# Altium schematic sheet MCU_Module.SchDoc
size A3
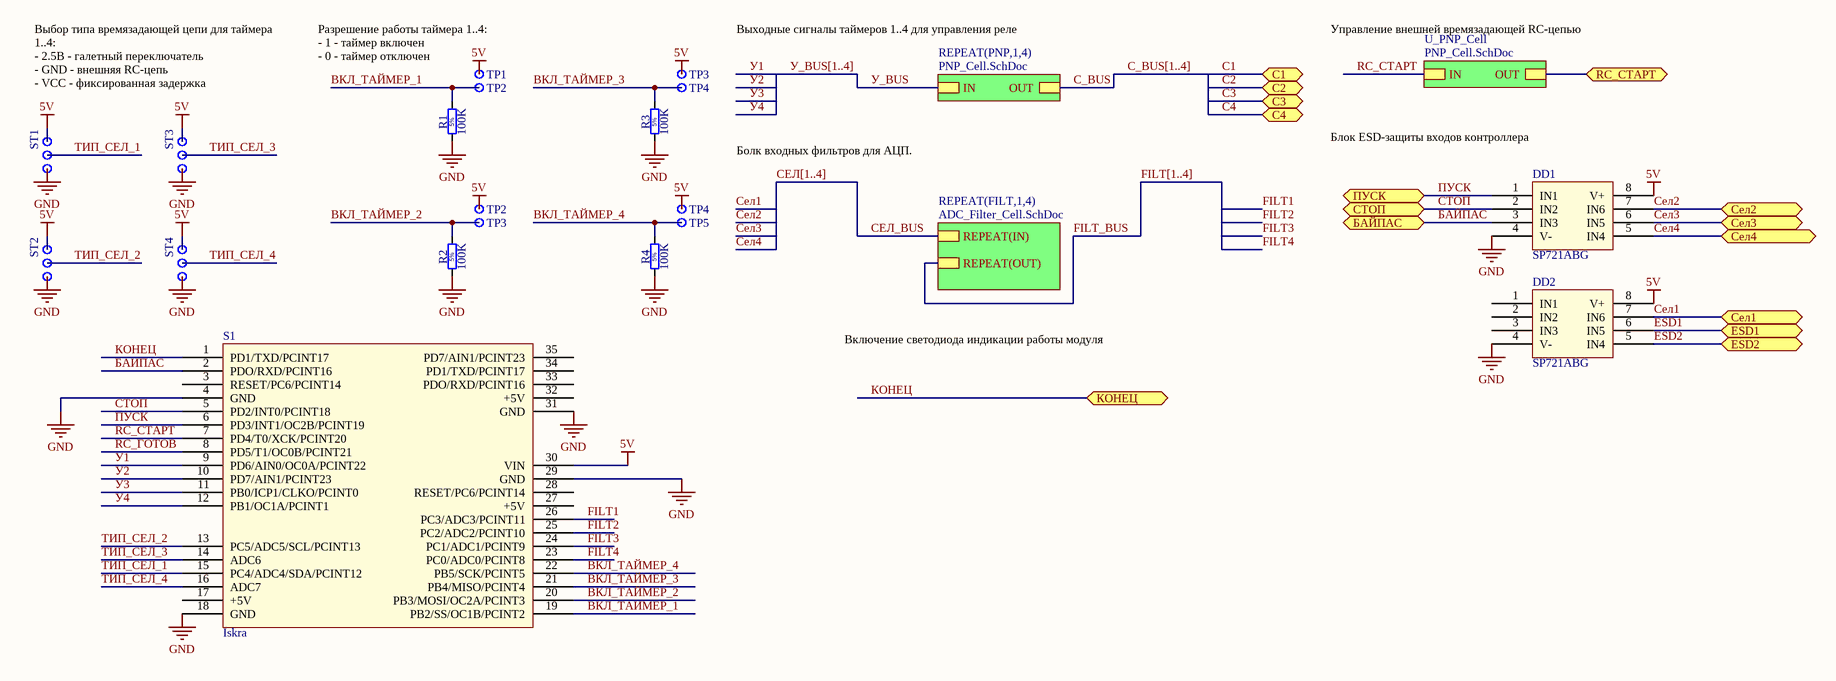
[diagram p0: MCU_Module.SchDoc]

## Parts
(Parts that share a designator on the sheet are numbered #1, #2 ... from top to bottom, then left to right.)
B12  Plated Hole  [MTG300_700]  (value not drawn)
B13  Plated Hole  [MTG300_700]  (value not drawn)
B14  Plated Hole  [MTG300_700]  (value not drawn)
B15  Plated Hole  [MTG300_700]  (value not drawn)
B22  Plated Hole  [MTG300_700]  (value not drawn)
B23  Plated Hole  [MTG300_700]  (value not drawn)
B24  Plated Hole  [MTG300_700]  (value not drawn)
B25  Plated Hole  [MTG300_700]  (value not drawn)
DD1  SP721ABG  [SOIC127P594X363-8N]
DD2  SP721ABG  [SOIC127P594X363-8N]
R1  100K  [RES_ARCOL_RCC025]
R2  100K  [RES_ARCOL_RCC025]
R3  100K  [RES_ARCOL_RCC025]
R4  100K  [RES_ARCOL_RCC025]
S1  Iskra  [Iskra]
ST1  Plated Hole  [MTG300_700]  (value not drawn)
ST2  Plated Hole  [MTG300_700]  (value not drawn)
ST3  Plated Hole  [MTG300_700]  (value not drawn)
ST4  Plated Hole  [MTG300_700]  (value not drawn)
TP1  Test Point  [TPS127]  (value not drawn)
TP2#1  Test Point  [TPS127]  (value not drawn)
TP2#2  Test Point  [TPS127]  (value not drawn)
TP3#1  Test Point  [TPS127]  (value not drawn)
TP3#2  Test Point  [TPS127]  (value not drawn)
TP4#1  Test Point  [TPS127]  (value not drawn)
TP4#2  Test Point  [TPS127]  (value not drawn)
TP5  Test Point  [TPS127]  (value not drawn)

## Sub-sheets
REPEAT(FILT,1,4) = ADC_Filter_Cell.SchDoc: REPEAT(IN), REPEAT(OUT)
REPEAT(PNP,1,4) = PNP_Cell.SchDoc: OUT, IN
U_PNP_Cell = PNP_Cell.SchDoc: OUT, IN

## Ports
ESD1, ESD2, RC_СТАРТ, БАЙПАС, КОНЕЦ, ПУСК, С1, С2, С3, С4, Сел1, Сел2, Сел3, Сел4, СТОП

## Nets
5V: B12.1 B13.1 B14.1 B15.1 DD1.8(V+) DD2.8(V+) S1.30(VIN) TP1.1 TP2#2.1 TP3#1.1 TP4#2.1
GND: B22.1 B23.1 B24.1 B25.1 DD1.4(V-) DD2.4(V-) R1.1 R2.1 R3.1 R4.1 S1.4(GND) S1.18(GND) S1.29(GND) S1.31(GND)
C1: port С1
C2: port С2
C3: port С3
C4: port С4
C_BUS: sheet REPEAT(PNP,1,4)/OUT
ESD1: DD2.6(IN5) ; port ESD1
ESD2: DD2.5(IN4) ; port ESD2
FILT1: S1.26(PC3/ADC3/PCINT11)
FILT2: S1.25(PC2/ADC2/PCINT10)
FILT3: S1.24(PC1/ADC1/PCINT9)
FILT4: S1.23(PC0/ADC0/PCINT8)
FILT_BUS: sheet REPEAT(FILT,1,4)/REPEAT(OUT)
RC_ГОТОВ: S1.8(PD5/T1/OC0B/PCINT21)
RC_СТАРТ: S1.7(PD4/T0/XCK/PCINT20) ; sheet U_PNP_Cell/IN
RC_СТАРТ: port RC_СТАРТ, sheet U_PNP_Cell/OUT  [a separate net that carries the same name]
БАЙПАС: DD1.3(IN3) S1.2(PDO/RXD/PCINT16) ; port БАЙПАС
ВКЛ_ТАЙМЕР_1: R1.2 S1.19(PB2/SS/OC1B/PCINT2) TP2#1.1
ВКЛ_ТАЙМЕР_2: R2.2 S1.20(PB3/MOSI/OC2A/PCINT3) TP3#2.1
ВКЛ_ТАЙМЕР_3: R3.2 S1.21(PB4/MISO/PCINT4) TP4#1.1
ВКЛ_ТАЙМЕР_4: R4.2 S1.22(PB5/SCK/PCINT5) TP5.1
КОНЕЦ: S1.1(PD1/TXD/PCINT17) ; port КОНЕЦ
ПУСК: DD1.1(IN1) S1.6(PD3/INT1/OC2B/PCINT19) ; port ПУСК
Сел1: DD2.7(IN6) ; port Сел1
Сел2: DD1.7(IN6) ; port Сел2
Сел3: DD1.6(IN5) ; port Сел3
Сел4: DD1.5(IN4) ; port Сел4
СЕЛ_BUS: sheet REPEAT(FILT,1,4)/REPEAT(IN)
СТОП: DD1.2(IN2) S1.5(PD2/INT0/PCINT18) ; port СТОП
ТИП_СЕЛ_1: S1.15(PC4/ADC4/SDA/PCINT12) ST1.1
ТИП_СЕЛ_2: S1.13(PC5/ADC5/SCL/PCINT13) ST2.1
ТИП_СЕЛ_3: S1.14(ADC6) ST3.1
ТИП_СЕЛ_4: S1.16(ADC7) ST4.1
У1: S1.9(PD6/AIN0/OC0A/PCINT22)
У2: S1.10(PD7/AIN1/PCINT23)
У3: S1.11(PB0/ICP1/CLKO/PCINT0)
У4: S1.12(PB1/OC1A/PCINT1)
У_BUS: sheet REPEAT(PNP,1,4)/IN

Not connected (* = marked no-connect by the designer): DD2 1(IN1) 2(IN2) 3(IN3); S1 3(RESET/PC6/PCINT14) 17(+5V) 27(+5V) 28(RESET/PC6/PCINT14) 32(+5V) 33(PDO/RXD/PCINT16) 34(PD1/TXD/PCINT17) 35(PD7/AIN1/PCINT23)

## Buses and harness runs
bus C_BUS[1..4]
bus FILT[1..4]
bus СЕЛ[1..4]
bus У_BUS[1..4]

## Notes on the sheet
- (near TP1) Разрешение работы таймера 1..4:
  - 1 - таймер включен
  - 0 - таймер отключен
- Выходные сигналы таймеров 1..4 для управления реле
- Управление внешней времязадающей RC-цепью
- Выбор типа времязадающей цепи для таймера 1..4:
  - 2.5В - галетный переключатель
  - GND - внешняя RC-цепь
  - VCC - фиксированная задержка
- Болк входных фильтров для АЦП.
- (near DD1) Блок ESD-защиты входов контроллера
- Включение светодиода индикации работы модуля
- (in symbol RCF_5K1_5%_0.25W_+10-6PPM_ARCOL_RCC025) 5%

## Library data of the parts
B12-B15 B22-B25 ST1-ST4 = PLATED_HOLE3.0_PAD7.0: Single Terminal Socket; Part Description: Plated Through Hole: Hole Dia.=3.0mm Pad Dia.=7.0mm; Mounted: No; Table: Pads; Part Number: PLATED_HOLE3.0_PAD7.0; Component Kind: Standard (No BOM); Component Type: Standard (No BOM); Pin Count: 1; Family: Plated Hole; Socket: No; SMD: No; Status: None; ComponentHeight: 0mm; Author: CERN DEM JLC; CreateDate: 26.05.2008; LatestRevisionDate: 26.05.2008; PackageDescription: Plated Through Hole: Hole Dia.=3.0mm Pad Dia.=7.0mm
R1-R4 = RCF_5K1_5%_0.25W_+10-6PPM_ARCOL_RCC025: Resistor - 5%; Part Description: Solid Carbon Resistor RCC Series; Manufacturer: ARCOL; Manufacturer Part Number: RCC025 5k1 J; Power: 0.25W; TC: +10-6ppm/°C; Table: Resistors THD; Part Number: RCF_5K1_5%_0.25W_+10-6PPM_ARCOL_RCC025; Component Kind: Standard; Component Type: Standard; Pin Count: 2; Value: 100K; Status: None; Tolerance: ±5%; Case: LS10.16 L6.3 x D2.4; Mounted: Yes; Socket: No; SMD: No; ComponentHeight: 2.5mm; HelpURL: \\cern.ch\dfs\Applications\Altium\Datasheets\RCF_ARCOL_RCC025.pdf; Author: CERN DEM JLC; CreateDate: 30.10.2013; LatestRevisionDate: 30.10.2013
S1 = Iskra_Holder
TP1 TP2#1 TP2#2 TP3#1 TP3#2 TP4#1 TP4#2 TP5 = SMD_PAD_1.27X1.27MM: Part Description: 1.27mm x 1.27mm PCB Copper Area (SMD Test Point); Mounted: No; Table: Pads; Part Number: SMD_PAD_1.27X1.27MM; Component Kind: Standard (No BOM); Component Type: Standard (No BOM); Pin Count: 1; Family: Test Point; Socket: No; SMD: Yes; Status: None; ComponentHeight: 0mm; Author: CERN DEM JLC; CreateDate: 12.01.2008; LatestRevisionDate: 12.01.2008; PackageDescription: 1.27mm x 1.27mm PCB Copper Area (SMD Test Point)